# Altium project PCB_TCS3200.PrjPcb
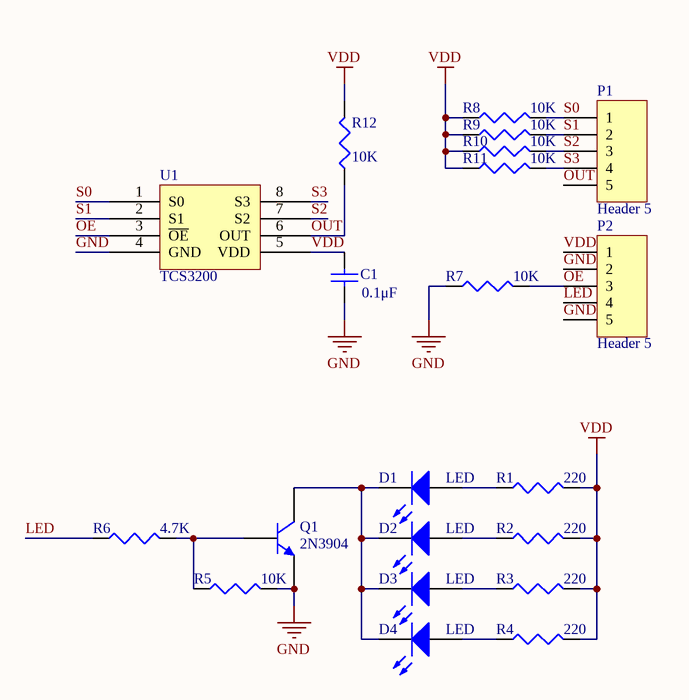
[diagram p0: TCS3200.SchDoc]
1 sheet, 21 parts. Net scope: global (net labels, ports and power ports of the same name join across sheets).
Board file: TCS3200.PcbDoc

## Sheet TCS3200.SchDoc
size A4

### Parts
C1  value 0.1μF  [1608[0603]]  (hidden comment: Cap Semi)
D1  LED  [3.2X1.6X1.1]
D2  LED  [3.2X1.6X1.1]
D3  LED  [3.2X1.6X1.1]
D4  LED  [3.2X1.6X1.1]
P1  Header 5  [HDR1X5]
P2  Header 5  [HDR1X5]
Q1  2N3904  [TO-92A]
R1  value 220  [J1-0603]
R2  value 220  [J1-0603]
R3  value 220  [J1-0603]
R4  value 220  [J1-0603]
R5  value 10K  [J1-0603]
R6  value 4.7K  [J1-0603]
R7  value 10K  [J1-0603]
R8  value 10K  [J1-0603]
R9  value 10K  [J1-0603]
R10  value 10K  [J1-0603]
R11  value 10K  [J1-0603]
R12  value 10K  [J1-0603]
U1  TCS3200  [TCS3200]

### Nets
GND: C1.1 P2.2 P2.5 Q1.1(E) R5.2 R7.1 U1.4(GND)
VDD: C1.2 P2.1 R1.2 R2.2 R3.2 R4.2 R8.1 R9.1 R10.1 R11.1 R12.2 U1.5(VDD)
LED: P2.4 R6.1
OE: P2.3 R7.2 U1.3(~{OE})
OUT: P1.5 R12.1 U1.6(OUT)
S0: P1.1 R8.2 U1.1(S0)
S1: P1.2 R9.2 U1.2(S1)
S2: P1.3 R10.2 U1.7(S2)
S3: P1.4 R11.2 U1.8(S3)
NetD1_1: D1.1(A) R1.1
NetD1_2: D1.2(K) D2.2(K) D3.2(K) D4.2(K) Q1.3(C)
NetD2_1: D2.1(A) R2.1
NetD3_1: D3.1(A) R3.1
NetD4_1: D4.1(A) R4.1
NetQ1_2: Q1.2(B) R5.1 R6.2

### Library data of the parts
C1 = Cap Semi: Capacitor (Semiconductor SIM Model); Published: 8-Jun-2000; LatestRevisionDate: 29-May-2009; LatestRevisionNote: IPC-7351 Footprint Added.; PackageReference: C1206; Publisher: Altium Limited; PackageDescription: Chip Capacitor
D1-D4 = LED2: Typical RED, GREEN, YELLOW, AMBER GaAs LED; Published: 8-Jun-2000; LatestRevisionDate: 17-Jul-2002; LatestRevisionNote: Re-released for DXP Platform.; PackageVersion: Feb-2002; PackageReference: 3.2X1.6X1.1; Publisher: Altium Limited; PackageDescription: SM LED; 2 Flat Leads
P1 P2 = Header 5: Header, 5-Pin; LatestRevisionDate: 17-Jul-2002; LatestRevisionNote: Re-released for DXP Platform.; Publisher: Altium Limited
Q1 = 2N3904: NPN General Purpose Amplifier; Published: 8-Jun-2000; LatestRevisionDate: 15-Jan-2003; LatestRevisionNote: PCB Footprint 'BCY-W3/D4.7' replaced; DatasheetVersion: 1997; PackageVersion: Sep-1998; PackageReference: TO-92A; Publisher: Altium Limited; PackageDescription: TO, Flat Index; 3 In-Line, Axial Leads; Body Dia. 4.5mm; Leads 0.51 x 0.48 mm (max); ComponentLink1Description: Manufacturer Link; ComponentLink1URL: http://www.fairchildsemi.com/; ComponentLink2Description: Datasheet; ComponentLink2URL: http://www.fairchildsemi.com/ds/2N%2F2N3904.pdf
R1-R12 = Res3: Resistor; Published: 8-Jun-2000; LatestRevisionDate: 29-May-2009; LatestRevisionNote: IPC-7351 Footprint Added.; PackageReference: J1-0603; Publisher: Altium Limited; PackageDescription: Chip Resistor